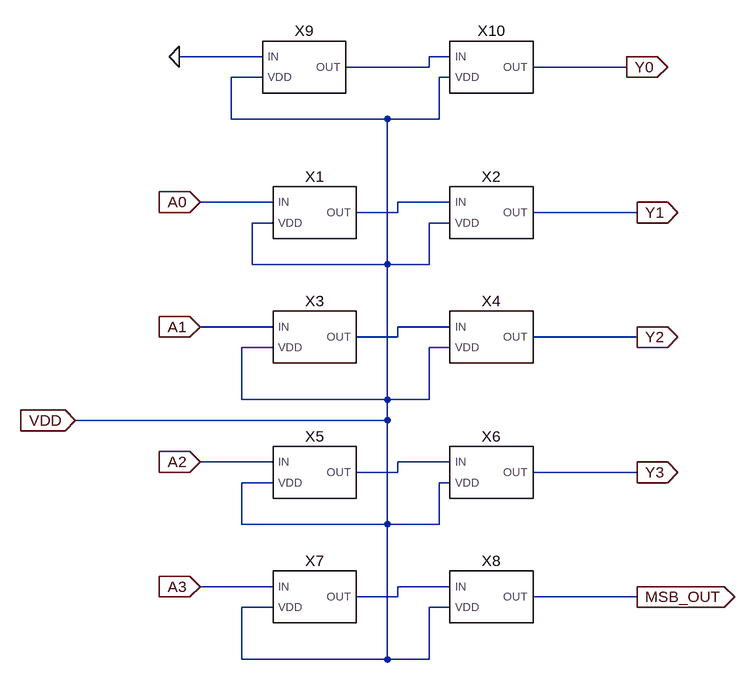
[diagram p0: schematic Shift4bit.asc]
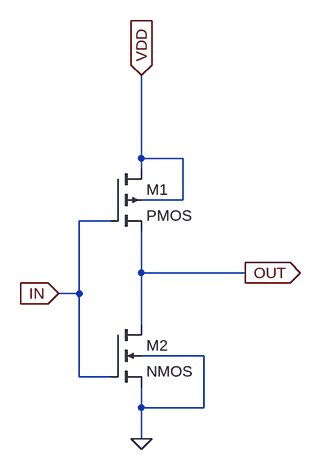
[diagram p1: sub-circuit not1.asc]
Shift4bit.asc, the LTspice schematic file:
Version 4.1
SHEET 1 880 824
WIRE 48 -112 -80 -112
WIRE 336 -112 304 -112
WIRE 304 -96 304 -112
WIRE 304 -96 176 -96
WIRE 608 -96 464 -96
WIRE 48 -80 0 -80
WIRE 336 -80 320 -80
WIRE 0 -16 0 -80
WIRE 240 -16 0 -16
WIRE 320 -16 320 -80
WIRE 320 -16 240 -16
WIRE 64 112 -48 112
WIRE 336 112 256 112
WIRE 256 128 256 112
WIRE 256 128 192 128
WIRE 624 128 464 128
WIRE 64 144 32 144
WIRE 336 144 304 144
WIRE 32 208 32 144
WIRE 240 208 240 -16
WIRE 240 208 32 208
WIRE 304 208 304 144
WIRE 304 208 240 208
WIRE 64 304 -48 304
WIRE 336 304 256 304
WIRE 256 320 256 304
WIRE 256 320 192 320
WIRE 624 320 464 320
WIRE 64 336 16 336
WIRE 336 336 304 336
WIRE 16 416 16 336
WIRE 240 416 240 208
WIRE 240 416 16 416
WIRE 304 416 304 336
WIRE 304 416 240 416
WIRE 240 448 240 416
WIRE 240 448 -240 448
WIRE 64 512 -48 512
WIRE 336 512 256 512
WIRE 256 528 256 512
WIRE 256 528 192 528
WIRE 624 528 464 528
WIRE 64 544 16 544
WIRE 336 544 320 544
WIRE 16 608 16 544
WIRE 240 608 240 448
WIRE 240 608 16 608
WIRE 320 608 320 544
WIRE 320 608 240 608
WIRE 64 704 -48 704
WIRE 336 704 256 704
WIRE 256 720 256 704
WIRE 256 720 192 720
WIRE 624 720 464 720
WIRE 64 736 16 736
WIRE 336 736 304 736
WIRE 16 816 16 736
WIRE 240 816 240 608
WIRE 240 816 16 816
WIRE 304 816 304 736
WIRE 304 816 240 816
FLAG -48 112 A0
IOPIN -48 112 In
FLAG -48 304 A1
IOPIN -48 304 In
FLAG -48 512 A2
IOPIN -48 512 In
FLAG -48 704 A3
IOPIN -48 704 In
FLAG 624 128 Y1
IOPIN 624 128 Out
FLAG 624 320 Y2
IOPIN 624 320 Out
FLAG 624 528 Y3
IOPIN 624 528 Out
FLAG 624 720 MSB_OUT
IOPIN 624 720 Out
FLAG -240 448 VDD
IOPIN -240 448 In
FLAG -80 -112 0
FLAG 608 -96 Y0
IOPIN 608 -96 Out
SYMBOL NOT1 128 128 R0
SYMATTR InstName X1
SYMBOL NOT1 400 128 R0
SYMATTR InstName X2
SYMBOL NOT1 128 320 R0
SYMATTR InstName X3
SYMBOL NOT1 400 320 R0
SYMATTR InstName X4
SYMBOL NOT1 128 528 R0
SYMATTR InstName X5
SYMBOL NOT1 400 528 R0
SYMATTR InstName X6
SYMBOL NOT1 128 720 R0
SYMATTR InstName X7
SYMBOL NOT1 400 720 R0
SYMATTR InstName X8
SYMBOL NOT1 112 -96 R0
SYMATTR InstName X9
SYMBOL NOT1 400 -96 R0
SYMATTR InstName X10

not1.asc, the sub-circuit schematic file:
Version 4.1
SHEET 1 880 680
WIRE 240 176 240 48
WIRE 304 176 240 176
WIRE 240 192 240 176
WIRE 304 240 304 176
WIRE 304 240 240 240
WIRE 192 272 144 272
WIRE 240 352 240 288
WIRE 400 352 240 352
WIRE 144 384 144 272
WIRE 144 384 112 384
WIRE 240 432 240 352
WIRE 336 480 240 480
WIRE 144 512 144 384
WIRE 192 512 144 512
WIRE 240 560 240 528
WIRE 336 560 336 480
WIRE 336 560 240 560
WIRE 240 608 240 560
FLAG 240 608 0
FLAG 112 384 IN
IOPIN 112 384 In
FLAG 400 352 OUT
IOPIN 400 352 Out
FLAG 240 48 VDD
IOPIN 240 48 In
SYMBOL pmos4 192 192 R0
SYMATTR InstName M1
SYMBOL nmos4 192 432 R0
SYMATTR InstName M2

The netlist it stands for:
* Shift4bit.asc
X§X1 A0 VDD N002 not1
X§X2 N002 VDD Y1 not1
X§X3 A1 VDD N003 not1
X§X4 N003 VDD Y2 not1
X§X5 A2 VDD N004 not1
X§X6 N004 VDD Y3 not1
X§X7 A3 VDD N005 not1
X§X8 N005 VDD MSB_OUT not1
X§X9 0 VDD N001 not1
X§X10 N001 VDD Y0 not1

* block symbol definitions
.subckt not1 IN VDD OUT
M1 VDD IN OUT VDD PMOS
M2 OUT IN 0 0 NMOS
.ends not1

.model NMOS NMOS
.model PMOS PMOS
.lib standard.mos
.backanno
.end